# EasyEDA Pro project ProProject_keyboard_Tassel43_2024-03-30.epro, board Tassel43_RGB
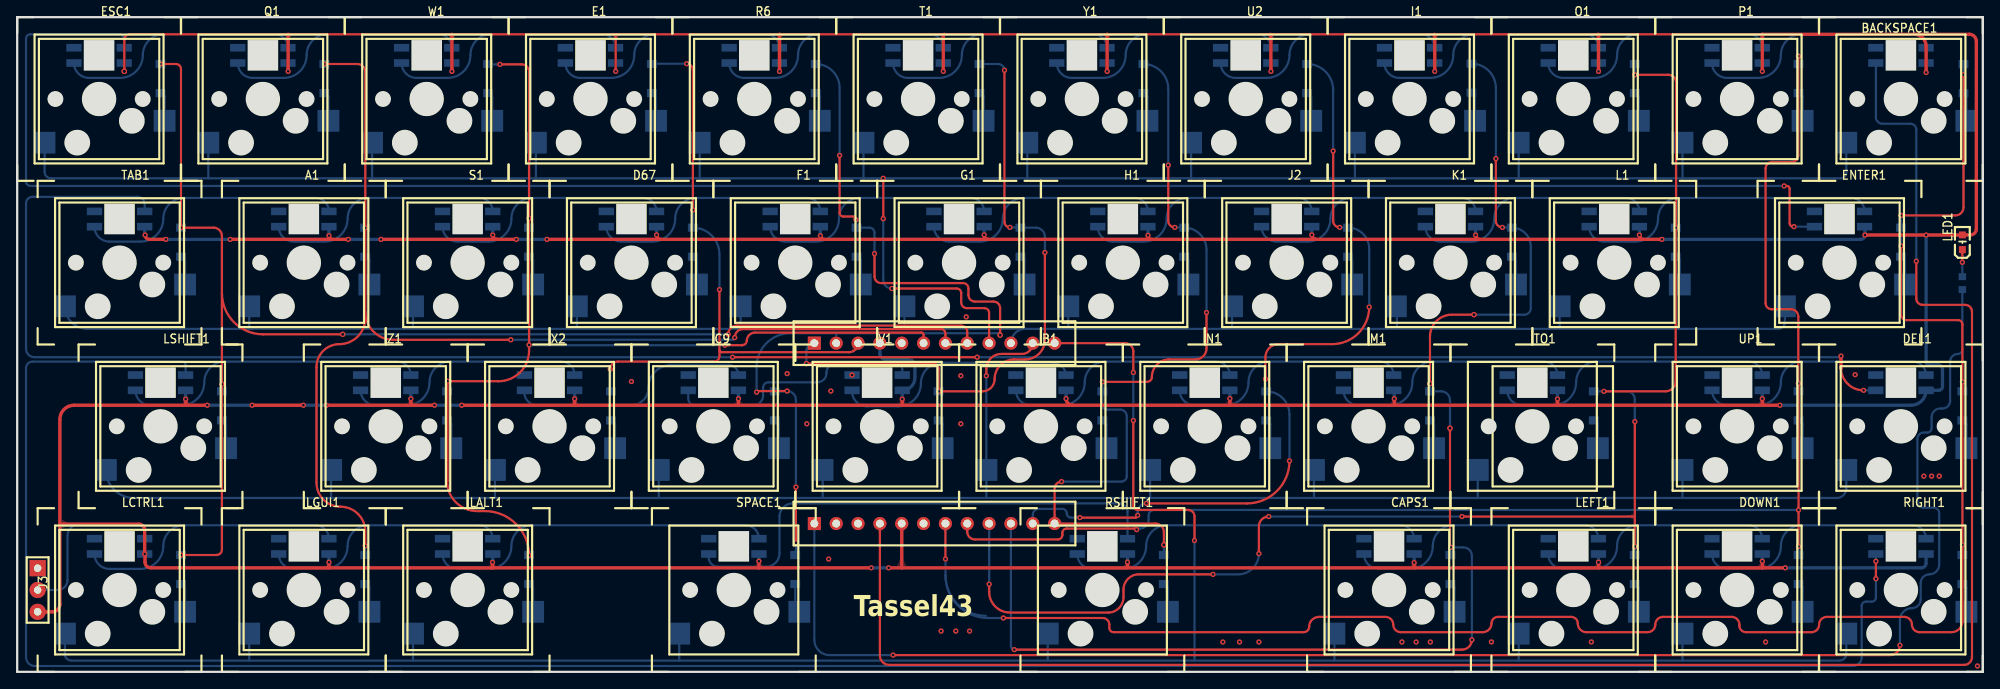
[diagram p11: board, top side]
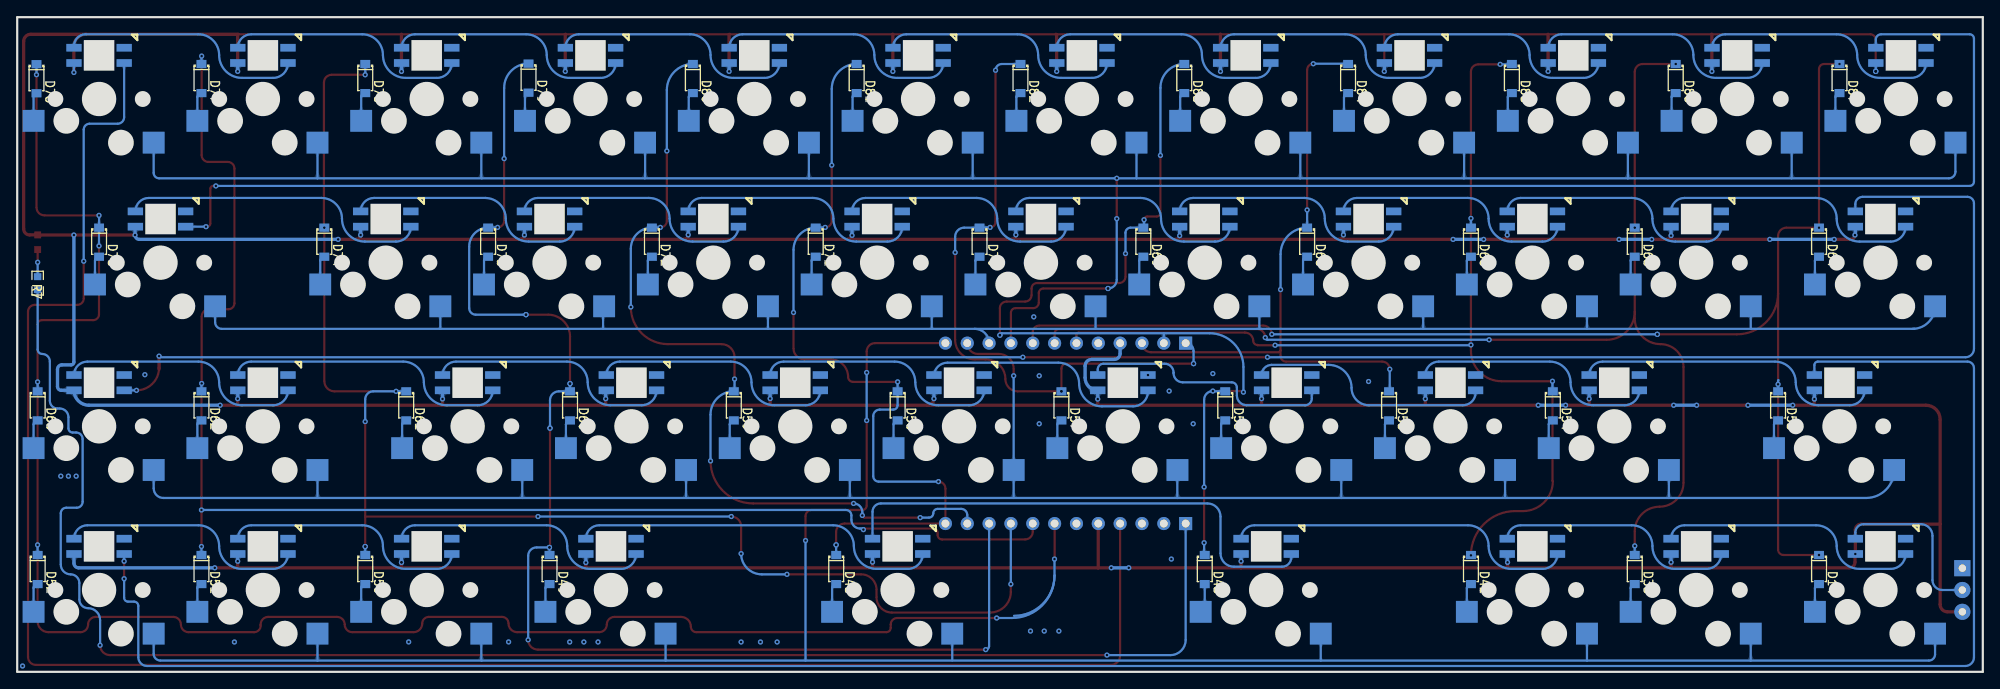
[diagram p12: board, bottom side, seen from below]

Outline 228.6 x 76.2 mm; copper layers: Top Layer, Bottom Layer. Coordinates in mm from the lower left corner of the outline.
Outline path: 0,76.2 228.6,76.2 228.6,0 0,0 0,76.2
Stack: Top Layer 0.035mm / Dielectric1 1.51mm FR4 er 4.5 / Bottom Layer 0.035mm

## Design rules (mm)
spacing Default (default): track to track 0.152, other pairs 0 to 0.152
track width Default (default): min 0.254, default 0.254, max 25.4
differential pair differentialPair (default): width min 0.127, default 0.254, max 2.54; gap min 0.152, default 0.152
via Default (default): diameter min 0.61, default 0.61, max 100.025; hole min 0.305, default 0.305, max 59.995
net GND uses gge543607(1)

## Placement (name value [footprint] x y rotation side)
A1  -  [凯华轴座+3528反贴灯]  33.34 47.62 0 top
B1  -  [凯华轴座+3528反贴灯]  119.06 28.57 0 top
BACKSPACE1  -  [凯华轴座+3528反贴灯]  219.08 66.68 0 top
C9  -  [凯华轴座+3528反贴灯]  80.96 28.57 0 top
CAPS1  -  [凯华轴座+3528反贴灯]  159.54 9.52 0 top
D14  1N4148W  [SOD-123_L2.8-W1.8-LS3.7-RD]  19.05 11.91 270 bottom
D35  1N4148W  [SOD-123_L2.8-W1.8-LS3.7-RD]  40.48 11.91 270 bottom
D41  1N4148W  [SOD-123_L2.8-W1.8-LS3.7-RD]  59.53 11.91 270 bottom
D43  1N4148W  [SOD-123_L2.8-W1.8-LS3.7-RD]  90.49 11.91 270 bottom
D45  1N4148W  [SOD-123_L2.8-W1.8-LS3.7-RD]  133.35 11.91 270 bottom
D49  1N4148W  [SOD-123_L2.8-W1.8-LS3.7-RD]  166.69 11.91 270 bottom
D50  1N4148W  [SOD-123_L2.8-W1.8-LS3.7-RD]  188.12 11.91 270 bottom
D51  1N4148W  [SOD-123_L2.8-W1.8-LS3.7-RD]  207.17 11.91 270 bottom
D52  1N4148W  [SOD-123_L2.8-W1.8-LS3.7-RD]  226.22 11.91 270 bottom
D53  1N4148W  [SOD-123_L2.8-W1.8-LS3.7-RD]  23.81 30.96 270 bottom
D54  1N4148W  [SOD-123_L2.8-W1.8-LS3.7-RD]  50 30.96 270 bottom
D55  1N4148W  [SOD-123_L2.8-W1.8-LS3.7-RD]  69.06 30.96 270 bottom
D56  1N4148W  [SOD-123_L2.8-W1.8-LS3.7-RD]  88.11 30.96 270 bottom
D57  1N4148W  [SOD-123_L2.8-W1.8-LS3.7-RD]  107.16 30.96 270 bottom
D58  1N4148W  [SOD-123_L2.8-W1.8-LS3.7-RD]  126.21 30.96 270 bottom
D59  1N4148W  [SOD-123_L2.8-W1.8-LS3.7-RD]  145.26 30.96 270 bottom
D60  1N4148W  [SOD-123_L2.8-W1.8-LS3.7-RD]  164.31 30.96 270 bottom
D61  1N4148W  [SOD-123_L2.8-W1.8-LS3.7-RD]  183.36 30.96 270 bottom
D62  1N4148W  [SOD-123_L2.8-W1.8-LS3.7-RD]  207.17 30.96 270 bottom
D63  1N4148W  [SOD-123_L2.8-W1.8-LS3.7-RD]  226.22 30.96 270 bottom
D64  1N4148W  [SOD-123_L2.8-W1.8-LS3.7-RD]  19.05 50.01 270 bottom
D65  1N4148W  [SOD-123_L2.8-W1.8-LS3.7-RD]  40.48 50.01 270 bottom
D66  1N4148W  [SOD-123_L2.8-W1.8-LS3.7-RD]  59.53 50.01 270 bottom
D67  -  [凯华轴座+3528反贴灯]  71.44 47.62 0 top
D68  1N4148W  [SOD-123_L2.8-W1.8-LS3.7-RD]  78.58 50.01 270 bottom
D69  1N4148W  [SOD-123_L2.8-W1.8-LS3.7-RD]  97.63 50.01 270 bottom
D70  1N4148W  [SOD-123_L2.8-W1.8-LS3.7-RD]  116.68 50.01 270 bottom
D71  1N4148W  [SOD-123_L2.8-W1.8-LS3.7-RD]  135.73 50.01 270 bottom
D72  1N4148W  [SOD-123_L2.8-W1.8-LS3.7-RD]  154.78 50.01 270 bottom
D73  1N4148W  [SOD-123_L2.8-W1.8-LS3.7-RD]  173.83 50.01 270 bottom
D74  1N4148W  [SOD-123_L2.8-W1.8-LS3.7-RD]  192.88 50.01 270 bottom
D75  1N4148W  [SOD-123_L2.8-W1.8-LS3.7-RD]  219.08 50.01 270 bottom
D76  1N4148W  [SOD-123_L2.8-W1.8-LS3.7-RD]  226.36 69.04 270 bottom
D77  1N4148W  [SOD-123_L2.8-W1.8-LS3.7-RD]  207.17 69.06 270 bottom
D78  1N4148W  [SOD-123_L2.8-W1.8-LS3.7-RD]  188.12 69.06 270 bottom
D79  1N4148W  [SOD-123_L2.8-W1.8-LS3.7-RD]  169.13 69.1 270 bottom
D80  1N4148W  [SOD-123_L2.8-W1.8-LS3.7-RD]  150.02 69.06 270 bottom
D81  1N4148W  [SOD-123_L2.8-W1.8-LS3.7-RD]  130.97 69.06 270 bottom
D82  1N4148W  [SOD-123_L2.8-W1.8-LS3.7-RD]  111.92 69.06 270 bottom
D83  1N4148W  [SOD-123_L2.8-W1.8-LS3.7-RD]  92.87 69.06 270 bottom
D84  1N4148W  [SOD-123_L2.8-W1.8-LS3.7-RD]  73.82 69.06 270 bottom
D85  1N4148W  [SOD-123_L2.8-W1.8-LS3.7-RD]  54.77 69.06 270 bottom
D86  1N4148W  [SOD-123_L2.8-W1.8-LS3.7-RD]  35.72 69.06 270 bottom
D87  1N4148W  [SOD-123_L2.8-W1.8-LS3.7-RD]  16.67 69.06 270 bottom
DEL1  -  [凯华轴座+3528反贴灯]  219.08 28.57 0 top
DOWN1  -  [凯华轴座+3528反贴灯]  200.03 9.52 0 top
E1  -  [凯华轴座+3528反贴灯]  66.67 66.68 0 top
ENTER1  -  [凯华轴座+3528反贴灯]  211.93 47.62 0 top
ESC1  -  [凯华轴座+3528反贴灯]  9.52 66.68 0 top
F1  -  [凯华轴座+3528反贴灯]  90.49 47.62 0 top
G1  -  [凯华轴座+3528反贴灯]  109.54 47.62 0 top
H1  -  [凯华轴座+3528反贴灯]  128.59 47.62 0 top
I1  -  [凯华轴座+3528反贴灯]  161.93 66.68 0 top
J2  -  [凯华轴座+3528反贴灯]  147.64 47.62 0 top
J3  -  [排针3P]  2.38 9.52 270 top
K1  -  [凯华轴座+3528反贴灯]  166.69 47.62 0 top
L1  -  [凯华轴座+3528反贴灯]  185.74 47.62 0 top
LALT1  -  [凯华轴座+3528反贴灯]  52.39 9.52 0 top
LCTRL1  -  [凯华轴座+3528反贴灯]  11.9 9.52 0 top
LED1  TJ-S1608SW6TGLC2R-A5  [LED0603-R-RD_RED]  226.22 50.01 90 top
LEFT1  -  [凯华轴座+3528反贴灯]  180.98 9.52 0 top
LGUI1  -  [凯华轴座+3528反贴灯]  33.34 9.52 0 top
LSHIFT1  -  [凯华轴座+3528反贴灯]  16.67 28.57 0 top
M1  -  [凯华轴座+3528反贴灯]  157.16 28.57 0 top
N1  -  [凯华轴座+3528反贴灯]  138.11 28.57 0 top
O1  -  [凯华轴座+3528反贴灯]  180.98 66.68 0 top
P1  -  [凯华轴座+3528反贴灯]  200.03 66.68 0 top
Q1  -  [凯华轴座+3528反贴灯]  28.57 66.68 0 top
R6  -  [凯华轴座+3528反贴灯]  85.72 66.68 0 top
R7  1kΩ  [R0603]  226.22 45.24 90 bottom
RIGHT1  -  [凯华轴座+3528反贴灯]  219.08 9.52 0 top
RSHIFT1  -  [凯华轴座+3528反贴灯]  126.21 9.52 0 top
S1  -  [凯华轴座+3528反贴灯]  52.39 47.62 0 top
SPACE1  -  [凯华轴座+3528反贴灯]  83.34 9.52 0 top
T1  -  [凯华轴座+3528反贴灯]  104.77 66.68 0 top
TAB1  -  [凯华轴座+3528反贴灯]  11.9 47.62 0 top
TO1  -  [凯华轴座+3528反贴灯]  176.21 28.57 0 top
U2  -  [凯华轴座+3528反贴灯]  142.88 66.68 0 top
U5  -  [1X12排针]  95.25 14.72 90 top
U6  -  [1X12排针]  95.25 35.72 90 top
UP1  -  [凯华轴座+3528反贴灯]  200.03 28.57 0 top
V1  -  [凯华轴座+3528反贴灯]  100.01 28.57 0 top
W1  -  [凯华轴座+3528反贴灯]  47.62 66.68 0 top
X2  -  [凯华轴座+3528反贴灯]  61.91 28.57 0 top
Y1  -  [凯华轴座+3528反贴灯]  123.83 66.68 0 top
Z1  -  [凯华轴座+3528反贴灯]  42.86 28.57 0 top

## Footprints (pads in the part's own frame, mm; a bottom-side part is the same pattern mirrored in y, then rotated)
1X12排针
  rect 1.524x1.524 hole 0.914: 1(2.54,2.54)
  round 1.524 hole 0.914: 2(2.541,0) 3(2.541,-2.54) 4(2.541,-5.08) 5(2.541,-7.62) 6(2.541,-10.16) 7(2.541,-12.7) 8(2.541,-15.24) 9(2.541,-17.78) 10(2.541,-20.32) 11(2.541,-22.86) 12(2.541,-25.4)
LED0603-R-RD_RED
  rect 0.8x0.8 smd: 1(0.851,0) 2(-0.851,0)
R0603
  rect 0.806x0.864 smd: 1(-0.753,0) 2(0.753,0)
SOD-123_L2.8-W1.8-LS3.7-RD
  rect 0.95x1.15 smd: 1(-1.692,0) 2(1.692,0)
凯华轴座+3528反贴灯
  rect 1.778x0.889 smd far side: 1(2.921,4.191) 2(2.921,5.969) 5(-2.921,5.969) 6(-2.921,4.191)
  rect 2.54x2.54 smd far side: 3(-6.35,-5.08) 4(7.62,-2.54)
排针3P
  rect 1.879x1.879 hole 0.864: 1(-2.54,0)
  round 1.879 hole 0.864: 2(0,0) 3(2.54,0)

## Nets
As in the schematic.

## Via types
v1: diameter 0.61, hole 0.305, Top Layer to Bottom Layer, 197 vias

## Routing (per net, layer and track width the routed paths; a pad name or vN(x,y) marks a point on that pad's centre or on a via; arc(x,y) is an arc through that point)
GND:
  vias: v1(71.44,33.79) v1(89.55,34.71) v1(91.83,28.87) v1(94.37,13.12) v1(94.63,32.68) v1(97.09,34.54) v1(107.45,4.74) v1(109.16,4.74) v1(109.74,34.46) v1(109.74,28.87) v1(110.37,41.32) v1(110.75,4.74) v1(140.22,3.47) v1(142.16,3.47) v1(144.41,3.47) v1(161.05,3.47) v1(162.7,3.47) v1(164.35,3.47) v1(171.45,3.48) v1(183.07,3.48) v1(203.34,3.47) v1(213.75,34.59) v1(221.74,22.77) v1(222.64,22.77) v1(223.53,22.77) v1(227.98,0.68)
V1_4: length 3.5
  Bottom Layer w0.254: V1.4 107.63,28.79 arc(107.49,29.12) D57.2
V1_6: length 29.7
  Bottom Layer w0.254: 121.98,34.42 arc(121.52,35.52) 120.42,35.98 107.51,35.98 arc(105.81,35.28) 105.1,33.57 arc(104.32,31.68) 102.43,30.9 98.83,30.9 arc(97.6,31.41) 97.09,32.64
VCC: length 1066.3
  Top Layer w0.254: 202.92,74.21 69.6,74.21 ; 69.6,74.21 13.09,74.21 arc(12.64,74.02) 12.46,73.57 v1(12.46,69.89) ; 69.6,74.21 arc(69.61,74.21) 69.61,74.2 v1(69.61,69.89) ; 14.82,16.53 arc(14.82,16.55) 14.79,16.56
  Top Layer w0.381: 122.75,31.03 102.93,31.03 ; 122.75,31.03 141.12,31.03 ; 122.75,31.03 arc(122.21,31.26) v1(121.98,31.8) ; 102.93,31.03 v1(102.93,31.74) ; 102.93,31.03 83.88,31.03 ; 19.61,31.03 6.61,31.03 arc(5.45,30.55) 4.96,29.38 4.96,17.2 ; 19.61,31.03 v1(22.11,31.03) ; 19.61,31.03 19.61,31.73 arc(19.6,31.74) v1(19.59,31.75) ; 102.88,12.11 129.04,12.11 ; 102.88,12.11 v1(101.36,12.11) ; 102.88,12.11 arc(102.87,12.11) 102.87,12.12 U5.5 ; 129.04,12.11 162.5,12.11 ; 129.04,12.11 arc(129.1,12.13) 129.13,12.19 v1(129.13,12.77) ; v1(160.16,31.79) 160.16,31.14 arc(160.19,31.06) 160.27,31.03 ; 83.88,31.03 64.83,31.03 ; 83.88,31.03 v1(83.88,31.79) ; 64.83,31.03 v1(64.83,31.78) ; 64.83,31.03 v1(51.7,31.03) ; v1(126.76,69.89) 126.76,74.18 arc(126.76,74.2) 126.78,74.21 ; v1(99.33,12.11) 86.26,12.11 ; 86.26,12.11 v1(86.26,12.87) ; 86.26,12.11 55.26,12.11 ; 202.96,31.03 v1(202.96,31.79) ; 202.96,31.03 v1(205,31.03) ; 202.96,31.03 179.16,31.03 ; v1(33.29,31.03) v1(27.32,31.03) ; v1(179.13,31.76) 179.13,31.05 arc(179.14,31.04) 179.16,31.03 ; 45.9,31.03 v1(48.52,31.03) ; 45.9,31.03 v1(35.95,31.03) ; 45.9,31.03 arc(45.82,31.06) 45.78,31.15 v1(45.78,31.78) ; 112.91,50.33 131.98,50.33 ; 112.91,50.33 93.84,50.33 ; 112.91,50.33 arc(112.59,50.47) 112.46,50.79 v1(112.46,50.86) ; 131.98,50.33 151.09,50.33 ; 131.98,50.33 arc(131.65,50.47) v1(131.51,50.8) ; 220.61,74.21 227.02,74.21 arc(227.61,73.97) 227.85,73.38 227.85,51.55 arc(227.65,51.06) 227.15,50.86 LED1.1 arc(226.22,50.85) 226.21,50.84 v1(222.01,50.84) v1(214.9,50.84) ; 220.61,74.21 202.92,74.21 arc(202.95,74.2) 202.96,74.17 v1(202.96,69.89) ; 220.61,74.21 arc(221.6,73.8) 222.01,72.81 v1(222.01,69.77) ; v1(50.56,69.89) 50.56,74.21 ; v1(183.91,69.89) 183.91,74.2 arc(183.9,74.21) 183.89,74.21 ; 170.11,50.33 189.17,50.33 ; 170.11,50.33 151.09,50.33 ; 170.11,50.33 arc(169.76,50.48) v1(169.61,50.84) ; 189.17,50.33 v1(191.27,50.33) ; 189.17,50.33 arc(188.81,50.48) v1(188.66,50.84) ; 160.27,31.03 141.12,31.03 ; 160.27,31.03 179.16,31.03 ; 141.12,31.03 arc(141.06,31.06) 141.03,31.12 v1(141.03,31.81) ; v1(162.47,12.72) 162.47,12.14 arc(162.47,12.12) 162.5,12.11 ; 55.26,12.11 36.21,12.11 ; 55.26,12.11 arc(55.27,12.11) 55.27,12.12 v1(55.27,12.74) ; 36.21,12.11 15.51,12.11 arc(15.06,12.3) 14.87,12.75 14.87,13.67 arc(14.86,13.7) v1(14.82,13.72) 14.82,16.53 arc(14.63,16.99) 14.16,17.19 4.98,17.19 arc(4.97,17.19) 4.96,17.2 ; 36.21,12.11 arc(36.24,12.12) 36.26,12.16 v1(36.26,12.75) ; v1(88.66,69.89) 88.66,74.21 arc(88.66,74.21) 88.66,74.21 ; 74.88,50.33 93.84,50.33 ; 74.88,50.33 v1(61.61,50.33) ; 74.88,50.33 arc(74.51,50.49) v1(74.36,50.85) ; 93.84,50.33 arc(93.53,50.46) v1(93.41,50.76) ; v1(17.28,50.33) 15.38,50.33 arc(15.02,50.48) v1(14.87,50.84) ; 162.5,12.11 183.89,12.11 ; 4.96,17.2 4.96,7.83 arc(4.72,7.23) 4.12,6.98 J3.3 ; v1(24.78,50.33) 36.7,50.33 ; 36.7,50.33 v1(38.51,50.33) ; 36.7,50.33 arc(36.39,50.46) v1(36.26,50.78) ; 183.89,12.11 202.96,12.11 ; 183.89,12.11 arc(183.9,12.11) 183.91,12.12 v1(183.91,12.74) ; v1(202.96,12.87) 202.96,12.11 arc(202.96,12.11) 202.96,12.11 ; 55.81,50.33 v1(58.05,50.33) ; 55.81,50.33 v1(42.3,50.33) ; 55.81,50.33 arc(55.46,50.48) v1(55.31,50.84) ; 151.09,50.33 arc(150.71,50.49) v1(150.56,50.86) ; v1(107.71,69.89) 107.71,74.11 arc(107.73,74.18) 107.8,74.21 ; v1(164.86,69.89) 164.86,74.19 arc(164.85,74.2) 164.84,74.21 ; v1(205.62,12.11) 202.96,12.11 ; v1(31.51,69.89) 31.51,74.18 arc(31.51,74.2) 31.53,74.21 ; v1(145.81,69.89) 145.81,74.16 arc(145.79,74.2) 145.76,74.21
  Bottom Layer w0.254: ESC1.1 v1(12.44,69.91) arc(12.45,69.9) v1(12.46,69.89) ; v1(222.01,69.77) 222.01,70.86 arc(222,70.86) BACKSPACE1.1 ; W1.1 arc(50.55,70.86) 50.56,70.85
  Bottom Layer w0.381: 131.51,51.82 v1(131.51,50.8) ; v1(58.05,50.33) v1(61.61,50.33) ; v1(202.96,69.89) 202.96,70.86 arc(202.95,70.86) P1.1 ; 112.46,51.82 v1(112.46,50.86) ; N1.1 v1(141.03,31.81) ; v1(222.01,50.84) 222.01,36.05 arc(222.1,35.82) 222.32,35.73 223.4,35.73 arc(223.76,35.58) 223.91,35.22 223.91,33.2 arc(223.79,32.89) 223.48,32.77 DEL1.1 arc(221.49,31.54) 220.26,31.03 v1(205,31.03) ; v1(205.62,12.11) 221.46,12.11 arc(221.84,12.26) 222,12.64 RIGHT1.1 ; v1(42.3,50.33) v1(38.51,50.33) ; LGUI1.1 v1(36.26,12.75) ; 50.56,70.85 v1(50.56,69.89) ; 36.26,51.82 v1(36.26,50.78) ; RSHIFT1.1 v1(129.13,12.77) ; v1(102.93,31.74) V1.1 arc(103.97,33.2) 104.41,34.24 104.41,35.6 arc(104.18,36.14) 103.64,36.36 101.02,36.36 arc(100.53,36.57) 100.33,37.05 U6.4 ; v1(51.7,31.03) v1(48.52,31.03) ; UP1.1 202.95,31.8 arc(202.95,31.79) v1(202.96,31.79) ; v1(183.91,12.74) 183.91,13.71 arc(183.9,13.71) LEFT1.1 ; v1(164.86,69.89) 164.86,70.86 arc(164.85,70.86) I1.1 ; O1.1 183.9,69.9 arc(183.9,69.89) v1(183.91,69.89) ; v1(169.61,50.84) 169.61,51.82 ; v1(191.27,50.33) 214.39,50.33 arc(214.75,50.48) v1(214.9,50.84) 214.9,51.77 arc(214.88,51.8) 214.85,51.82 ; v1(160.16,31.79) 160.16,32.69 arc(160.14,32.74) M1.1 ; X2.1 v1(64.83,31.78) ; v1(107.71,69.89) 107.71,70.85 arc(107.7,70.86) T1.1 ; 14.82,51.82 14.82,50.89 arc(14.84,50.86) v1(14.87,50.84) ; SPACE1.1 v1(86.26,12.87) ; v1(88.66,69.89) 88.66,70.85 arc(88.65,70.86) R6.1 ; TO1.1 v1(179.13,31.76) ; 150.56,51.82 v1(150.56,50.86) ; v1(188.66,50.84) 188.66,51.82 ; 74.36,51.82 v1(74.36,50.85) ; v1(202.96,12.87) 202.96,13.71 arc(202.95,13.71) DOWN1.1 ; E1.1 69.59,69.9 arc(69.6,69.9) v1(69.61,69.89) ; CAPS1.1 v1(162.47,12.72) ; v1(45.78,31.78) Z1.1 ; 55.31,51.82 v1(55.31,50.84) ; 93.41,51.82 v1(93.41,50.76) ; v1(24.78,50.33) v1(17.28,50.33) ; v1(35.95,31.03) v1(33.29,31.03) ; C9.1 v1(83.88,31.79) ; B1.1 v1(121.98,31.8) ; v1(145.81,69.89) 145.81,70.86 arc(145.8,70.86) U2.1 ; v1(31.51,69.89) 31.51,70.85 arc(31.5,70.86) 31.49,70.87 ; LSHIFT1.1 v1(19.59,31.75) ; v1(126.76,69.89) 126.76,70.86 arc(126.75,70.86) Y1.1 ; v1(101.36,12.11) v1(99.33,12.11) ; v1(27.32,31.03) v1(22.11,31.03) ; LALT1.1 55.31,12.78 arc(55.3,12.75) v1(55.27,12.74)
A1_4: length 3.5
  Bottom Layer w0.254: A1.4 40.96,47.84 arc(40.82,48.17) D65.2
A1_6: length 29.7
  Bottom Layer w0.254: S1.2 arc(54.85,54.7) 53.74,55.16 40.84,55.16 arc(39.13,54.45) 38.43,52.75 arc(37.64,50.86) 35.76,50.08 32.15,50.08 arc(30.92,50.59) 30.41,51.82
B1_4: length 3.5
  Bottom Layer w0.254: B1.4 126.68,28.79 arc(126.54,29.12) D58.2
B1_6: length 29.7
  Bottom Layer w0.254: B1.6 arc(116.65,31.54) 117.88,31.03 121.49,31.03 arc(123.37,31.81) 124.15,33.7 arc(124.86,35.4) 126.56,36.11 139.47,36.11 arc(140.58,35.65) N1.2
BACKSPACE1_2: length 29.8
  Bottom Layer w0.254: BACKSPACE1.2 222,72.84 arc(221.6,73.81) 220.63,74.21 207.53,74.21 arc(205.82,73.5) 205.12,71.8 arc(204.33,69.91) 202.45,69.13 198.84,69.13 arc(197.61,69.64) P1.6
C9_4: length 3.5
  Bottom Layer w0.254: C9.4 88.58,28.79 arc(88.44,29.12) D56.2
C9_6: length 30.5
  Bottom Layer w0.254: C9.6 78.04,31.82 arc(78.27,31.26) 78.83,31.03 85.61,31.03 arc(86.42,31.36) 86.75,32.17 86.75,33.09 arc(86.93,33.52) 87.36,33.7 93.04,33.7 arc(93.8,34.01) 94.12,34.77 94.12,34.84 arc(94.42,35.56) 95.13,35.86 102.28,35.86 arc(102.74,35.67) 102.93,35.21 V1.2
CAPLED: length 190.7
  Top Layer w0.254: v1(101.87,1.95) 217.82,1.95 arc(218.62,2.28) v1(218.96,3.09)
  Bottom Layer w0.254: U5.1 92.71,3.71 arc(93.23,2.46) 94.47,1.95 v1(101.87,1.95) ; R7.1 226.22,37.53 arc(226.07,37.15) 225.69,37 arc(225.06,36.74) 224.8,36.11 224.8,31.54 arc(224.54,30.91) 223.91,30.65 223.66,30.65 arc(222.94,30.35) 222.64,29.63 222.64,28.35 arc(222.5,28) 222.15,27.85 221.75,27.85 arc(221.21,27.63) 220.99,27.09 220.99,19.79 arc(221.19,19.3) 221.69,19.1 222.9,19.1 arc(223.35,18.91) 223.53,18.46 223.53,12.49 arc(223.2,11.68) 222.39,11.34 arc(221.67,11.05) 221.37,10.33 221.37,8.42 arc(221.07,7.71) 220.36,7.41 arc(219.37,7) 218.96,6.01 v1(218.96,3.09)
CAPS1_4: length 3.5
  Bottom Layer w0.254: CAPS1.4 167.16,9.74 arc(167.03,10.07) D49.2
CAPS1_6: length 32.1
  Bottom Layer w0.254: LEFT1.2 arc(183.44,16.6) 182.33,17.06 167.05,17.06 arc(165.34,16.35) 164.63,14.65 arc(163.85,12.76) 161.97,11.98 158.36,11.98 arc(157.13,12.49) CAPS1.6
COL0: length 161.2
  Top Layer w0.254: 23.81,44.08 v1(23.81,33.47) 23.81,14.23 arc(23.62,13.78) 23.17,13.6 v1(19.05,13.6) ; 23.81,44.08 23.81,50.73 arc(23.53,51.41) 22.84,51.7 v1(19.05,51.7) 19.05,70.16 arc(18.88,70.58) 18.46,70.75 v1(16.67,70.75) ; 23.81,44.08 arc(25.21,40.69) 28.61,39.28 v1(37.86,39.28) ; U6.8 110.49,39.55 arc(110.27,40.08) 109.74,40.3 83.7,40.3 arc(82.99,40) v1(82.69,39.28)
  Bottom Layer w0.254: D53.1 v1(23.81,33.47) 23.81,33.9 arc(23.8,33.94) 23.76,33.95 ; v1(37.86,39.28) v1(82.69,39.28)
COL1: length 139.5
  Top Layer w0.254: v1(57.41,38.65) 43.74,38.65 arc(41.43,39.6) 40.48,41.91 ; 40.48,41.91 40.48,41.15 arc(39.6,39.02) 37.48,38.14 arc(35.59,37.36) 34.81,35.47 34.81,22.01 arc(35.63,20.04) 37.6,19.22 arc(39.64,18.38) 40.48,16.34 v1(40.48,14.66) ; 40.48,41.91 v1(40.48,51.7) 40.48,69.83 arc(40.21,70.48) 39.56,70.75 v1(35.72,70.75) ; U6.7 107.95,39.39 arc(107.8,39.75) 107.44,39.89 84.24,39.89 arc(83.67,39.54) v1(83.45,38.9)
  Bottom Layer w0.254: v1(40.48,14.66) D35.1 ; v1(57.41,38.65) 83.2,38.65 arc(83.38,38.72) v1(83.45,38.9)
COL2: length 125.5
  Top Layer w0.254: v1(82.31,38.02) 84.34,38.02 84.37,38.05 arc(84.71,38.19) 84.85,38.52 arc(85.13,39.21) 85.81,39.49 105.16,39.49 arc(105.34,39.42) 105.41,39.24 U6.6 ; v1(56.13,70.71) 58.68,70.71 arc(59.28,70.46) 59.53,69.86 v1(59.53,52.78) v1(59.53,38.05) 59.53,37.37 arc(58.49,34.86) 55.98,33.82 v1(50.05,33.82) 50.05,22.23 50,22.18 arc(51.02,19.73) 53.48,18.71 54.38,18.71 arc(58.02,17.2) v1(59.53,13.56)
  Bottom Layer w0.254: v1(59.53,38.05) 59.56,38.02 v1(82.31,38.02) ; v1(50.05,33.82) 50.05,32.69 50,32.65 ; v1(56.13,70.71) 54.81,70.71 arc(54.78,70.72) D85.1 ; D66.1 v1(59.53,52.78)
COL3: length 73.3
  Top Layer w0.254: v1(81.67,44.49) 81.67,37.4 ; 81.67,37.4 81.87,37.2 96.73,37.2 arc(97.48,37.51) U6.3 ; 81.67,37.4 81.67,36.74 arc(81.49,36.3) 81.04,36.11 69.86,36.11 arc(69.23,35.85) v1(68.97,35.22) ; v1(78.58,53.76) 78.58,70.06 arc(78.37,70.57) v1(77.86,70.78)
  Bottom Layer w0.254: v1(81.67,44.49) 81.67,48.61 arc(80.77,50.79) D68.1 v1(78.58,53.76) ; v1(77.86,70.78) 73.85,70.78 arc(73.83,70.77) D84.1 ; v1(68.97,35.22) 68.97,32.73 arc(69,32.67) D55.1
COL4: length 109.6
  Top Layer w0.254: v1(85.99,32.55) 85.99,32.68 v1(89.55,32.68) ; v1(99.71,48.68) 99.71,46 arc(99.93,45.47) 100.46,45.25 109.99,45.25 arc(110.44,45.07) 110.63,44.62 110.63,43.86 arc(110.85,43.32) 111.39,43.09 113.56,43.09 arc(114.09,42.87) 114.31,42.34 v1(114.31,39.19) ; v1(95.64,60.11) 95.64,53.44 arc(95.77,53.13) 96.08,53 97.17,53 arc(97.44,52.89) v1(97.55,52.62) ; v1(90.56,21.5) v1(90.56,15.03)
  Bottom Layer w0.254: 95.27,39.41 114.09,39.41 arc(114.25,39.35) v1(114.31,39.19) ; 95.27,39.41 89.93,39.41 arc(87.14,38.26) 85.99,35.47 v1(85.99,32.55) ; 95.27,39.41 arc(95.26,39.4) 95.25,39.39 U6.2 ; v1(99.71,48.68) 99.71,51.1 arc(99.53,51.52) 99.11,51.7 D69.1 arc(97.57,51.72) 97.55,51.78 v1(97.55,52.62) ; D56.1 89.51,32.65 arc(89.54,32.66) v1(89.55,32.68) arc(90.26,32.38) 90.56,31.66 v1(90.56,21.5) ; v1(90.56,15.03) 90.56,13.78 90.44,13.65 arc(90.45,13.61) D43.1 ; v1(95.64,60.11) 95.64,67.98 arc(94.83,69.94) D83.1
COL5: length 75.7
  Top Layer w0.254: v1(114.82,70.02) 114.82,52.37 arc(115,51.92) v1(115.45,51.73) ; v1(91.79,35.87) 106.59,35.87 arc(106.99,35.71) 107.16,35.31 v1(107.16,32.65) 112.25,32.65 arc(113.26,33.07) 113.68,34.08 arc(114.35,35.69) 115.96,36.36 117.23,36.36 arc(118.85,37.03) 119.52,38.65 v1(119.52,48.81)
  Bottom Layer w0.254: v1(115.45,51.73) 116.65,51.73 arc(116.67,51.72) D70.1 118.47,51.7 arc(119.21,51.39) 119.52,50.65 v1(119.52,48.81) ; D82.1 114.09,70.75 arc(114.61,70.54) v1(114.82,70.02) ; v1(91.79,35.87) 91.79,37.34 arc(92.06,37.99) U6.1
COL6: length 94.1
  Top Layer w0.254: v1(126.21,33.75) 131.38,33.75 arc(131.79,33.92) 131.96,34.33 arc(132.56,35.77) 134,36.36 137.04,36.36 arc(137.94,36.74) 138.31,37.63 v1(138.31,41.82) ; v1(133.36,14.77) 133.36,16.28 arc(133.07,16.97) 132.38,17.26 U5.12 120.65,21.33 arc(120.89,21.9) v1(121.46,22.14) ; v1(133.87,58.97) 133.87,52.49 arc(134.09,51.95) v1(134.63,51.73)
  Bottom Layer w0.254: v1(126.21,33.75) D58.1 126.21,31.03 arc(126.36,30.67) 126.72,30.52 128.28,30.52 arc(128.82,30.3) 129.04,29.76 129.04,22.77 arc(128.86,22.33) 128.41,22.14 v1(121.46,22.14) ; v1(138.31,41.82) 138.31,49.12 arc(137.56,50.94) D71.1 arc(135.72,51.72) 135.7,51.73 v1(134.63,51.73) ; 133.35,14.1 133.36,14.11 v1(133.36,14.77) ; v1(133.87,58.97) 133.87,67.85 arc(133.02,69.9) D81.1
COL7: length 97.6
  Top Layer w0.254: v1(145.17,34.08) 145.17,36.62 arc(145.62,37.7) 146.7,38.14 152.92,38.14 arc(155.97,39.41) v1(157.24,42.46) ; v1(123.58,17.95) 130.06,17.95 arc(130.24,18.02) v1(130.31,18.2) ; v1(153.05,60.62) 153.05,52.49 arc(153.27,51.95) v1(153.81,51.73) ; v1(131.33,19.6) 143.01,19.6 arc(146.52,21.05) v1(147.97,24.55)
  Bottom Layer w0.254: v1(147.97,24.55) 147.97,29.94 arc(147.17,31.85) D59.1 arc(145.2,32.67) 145.17,32.73 v1(145.17,34.08) ; v1(123.58,17.95) 122.57,17.95 arc(122.21,18.1) 122.06,18.46 arc(121.91,18.82) 121.55,18.97 118.82,18.97 arc(118.32,18.76) 118.11,18.26 U5.11 ; v1(157.24,42.46) 157.24,49.24 arc(156.52,50.98) D72.1 arc(154.77,51.72) 154.75,51.73 v1(153.81,51.73) ; v1(130.31,18.2) 130.31,18.58 arc(130.61,19.3) v1(131.33,19.6) ; v1(153.05,60.62) 153.05,67.72 arc(152.16,69.86) D80.1
COL8: length 155.3
  Top Layer w0.254: v1(166.63,28.36) 166.63,14.54 ; v1(115.96,2.58) 168.03,2.58 arc(168.84,2.92) v1(169.18,3.72) ; v1(164.31,33.55) 164.31,39.02 arc(165.05,40.82) 166.86,41.57 v1(169.43,41.57) ; v1(171.97,59.73) 171.97,52.49 arc(172.19,51.95) v1(172.73,51.73)
  Bottom Layer w0.254: v1(171.97,59.73) 171.97,67.96 arc(171.14,69.96) D79.1 ; v1(169.18,3.72) 169.18,13.5 arc(168.89,14.19) 168.19,14.48 v1(166.7,14.48) 166.7,13.61 arc(166.69,13.6) D49.1 ; v1(166.63,28.36) 166.63,31.61 arc(166.33,32.34) 165.6,32.65 D60.1 v1(164.31,33.55) ; v1(172.73,51.73) 173.8,51.73 arc(173.82,51.72) D73.1 arc(175.39,51.05) 176.03,49.5 176.03,42.33 arc(175.81,41.79) 175.27,41.57 v1(169.43,41.57) ; U5.10 115.57,2.97 arc(115.68,2.7) v1(115.96,2.58)
COL9: length 166.3
  Top Layer w0.254: v1(184.53,32.65) 191.7,32.65 arc(192.54,32.99) 192.88,33.83 v1(192.88,51.7) arc(192.91,51.71) 192.92,51.74 192.92,68.6 arc(192.66,69.23) 192.03,69.49 v1(188.13,69.49) ; v1(188.13,14.58) 188.13,18.08 ; 188.13,18.08 v1(168.03,18.08) ; 188.13,18.08 v1(188.13,29.12) ; v1(144.41,13.76) 144.41,16.93 arc(144.74,17.74) v1(145.55,18.08) ; v1(139.08,11.34) 130.44,11.34 arc(129.18,10.82) 128.66,9.57 128.66,8.68 arc(128.14,7.42) 126.88,6.9 115.45,6.9 arc(113.75,7.61) 113.04,9.31 v1(113.04,10.2)
  Bottom Layer w0.254: v1(168.03,18.08) v1(145.55,18.08) ; v1(113.04,10.2) 113.04,17.25 arc(113.04,17.26) U5.9 ; D61.1 v1(184.53,32.65) 187.19,32.65 arc(187.85,32.37) 188.13,31.71 v1(188.13,29.12) ; v1(188.13,14.58) 188.13,13.61 arc(188.13,13.6) D50.1 ; D78.1 188.12,69.5 arc(188.12,69.5) v1(188.13,69.49) ; v1(139.08,11.34) 142,11.34 arc(143.7,12.05) v1(144.41,13.76)
COL10: length 166.8
  Top Layer w0.254: U5.8 110.49,16.31 arc(110.75,15.67) 111.39,15.41 121.04,15.41 arc(121.4,15.56) 121.55,15.92 121.55,16.17 arc(121.7,16.53) 122.06,16.68 130.06,16.68 arc(130.15,16.64) v1(130.19,16.55) ; v1(207.15,71.67) 207.15,60.14 arc(206.92,59.58) 206.36,59.35 204.11,59.35 arc(203.56,59.13) 203.34,58.58 203.34,42.9 arc(203.54,42.41) 204.03,42.21 206.28,42.21 arc(206.89,41.95) 207.15,41.34 v1(207.15,33.57) arc(207.16,33.56) 207.17,33.55 v1(207.17,18.84) v1(207.17,14.59)
  Bottom Layer w0.254: D77.1 207.17,71.65 arc(207.16,71.66) v1(207.15,71.67) ; D51.1 v1(207.17,14.59) ; D62.1 207.17,33.55 arc(207.16,33.56) v1(207.15,33.57) ; v1(207.17,18.84) 132.22,18.84 arc(131.77,18.65) 131.58,18.2 131.58,17.69 arc(131.29,16.98) 130.57,16.68 130.31,16.68 arc(130.22,16.64) v1(130.19,16.55)
COL11: length 225.2
  Top Layer w0.254: v1(226.36,69.5) 226.36,54.06 arc(226.08,53.4) 225.42,53.13 v1(219.09,53.13) ; v1(219.09,49.57) 219.09,41.61 arc(219.28,41.13) 219.76,40.94 225.73,40.94 arc(226.08,40.79) 226.23,40.44 v1(226.23,33.74) v1(226.23,14.77) 226.23,5.89 arc(225.86,4.99) 224.96,4.61 221.25,4.61 arc(220.62,4.87) 220.36,5.5 arc(220.1,6.13) 219.47,6.39 210.45,6.39 arc(209.82,6.13) 209.56,5.5 arc(209.3,4.87) 208.67,4.61 201.05,4.61 arc(200.51,4.84) 200.29,5.38 200.29,5.5 arc(200.03,6.13) 199.4,6.39 191.4,6.39 arc(190.77,6.13) 190.51,5.5 arc(190.25,4.87) 189.62,4.61 182.51,4.61 arc(181.79,4.91) 181.49,5.63 arc(181.27,6.17) 180.73,6.39 172.22,6.39 arc(171.68,6.17) 171.46,5.63 arc(171.16,4.91) 170.44,4.61 160.92,4.61 arc(160.29,4.87) 160.03,5.5 arc(159.77,6.13) 159.14,6.39 151.4,6.39 arc(150.59,6.06) 150.25,5.25 arc(150.07,4.8) 149.62,4.61 127.52,4.61 arc(127.16,4.76) 127.01,5.12 127.01,5.5 arc(126.79,6.04) 126.25,6.26 v1(114.69,6.26) ; U5.7 107.95,13.13 arc(107.95,13.13) v1(107.96,13.12)
  Bottom Layer w0.254: v1(107.96,13.12) 107.96,11.22 ; 107.96,11.22 arc(109.34,7.9) 112.66,6.52 ; 107.96,11.22 arc(109.41,7.72) 112.91,6.26 v1(114.69,6.26) ; v1(219.09,49.57) 219.09,51.69 arc(219.08,51.7) D75.1 219.08,53.12 arc(219.08,53.13) v1(219.09,53.13) ; v1(226.36,69.5) D76.1 ; D63.1 226.22,33.73 arc(226.22,33.74) v1(226.23,33.74) ; v1(226.23,14.77) 226.23,13.61 arc(226.23,13.6) D52.1
D14_2: length 3.5
  Bottom Layer w0.254: 19.52,6.98 19.52,9.74 arc(19.38,10.07) D14.2
D53_2: length 3.5
  Bottom Layer w0.254: LSHIFT1.4 24.29,28.79 arc(24.15,29.12) D53.2
D64_2: length 3.5
  Bottom Layer w0.254: 19.52,45.08 19.52,47.84 arc(19.38,48.17) D64.2
D67_4: length 3.5
  Bottom Layer w0.254: D67.4 79.06,47.84 arc(78.92,48.17) D68.2
D67_6: length 29.7
  Bottom Layer w0.254: F1.2 arc(92.95,54.7) 91.84,55.16 78.94,55.16 arc(77.23,54.45) 76.53,52.75 arc(75.74,50.86) 73.86,50.08 70.25,50.08 arc(69.02,50.59) 68.52,51.82
D76_2: length 3.4
  Bottom Layer w0.254: BACKSPACE1.4 226.7,67 arc(226.6,67.24) D76.2
D77_2: length 3.5
  Bottom Layer w0.254: P1.4 207.65,66.89 arc(207.51,67.22) D77.2
D78_2: length 3.5
  Bottom Layer w0.254: O1.4 188.6,66.89 arc(188.46,67.22) D78.2
D79_2: length 3.5
  Bottom Layer w0.254: 169.55,64.14 169.55,67 arc(169.43,67.29) D79.2
D80_2: length 3.5
  Bottom Layer w0.254: U2.4 150.5,66.89 arc(150.36,67.22) D80.2
D81_2: length 3.5
  Bottom Layer w0.254: Y1.4 131.44,66.89 arc(131.31,67.22) D81.2
D82_2: length 3.5
  Bottom Layer w0.254: T1.4 112.39,66.89 arc(112.26,67.22) D82.2
D83_2: length 3.5
  Bottom Layer w0.254: R6.4 93.34,66.89 arc(93.2,67.22) D83.2
D84_2: length 3.5
  Bottom Layer w0.254: E1.4 74.29,66.89 arc(74.15,67.22) D84.2
D85_2: length 3.5
  Bottom Layer w0.254: W1.4 55.24,66.89 arc(55.1,67.22) D85.2
D86_2: length 3.5
  Bottom Layer w0.254: Q1.4 36.19,66.89 arc(36.05,67.22) D86.2
DEL1_4: length 3.5
  Bottom Layer w0.254: DEL1.4 226.7,28.79 arc(226.56,29.12) D63.2
DEL1_6: length 251.3
  Top Layer w0.254: v1(111.64,36.62) v1(83.2,36.62) ; 212.1,35.4 arc(212.87,33.54) v1(214.73,32.77)
  Top Layer w0.381: v1(212.1,36.74) 212.1,35.22
  Bottom Layer w0.254: TAB1.2 14.82,54.44 arc(14.58,55.04) 13.98,55.29 1.79,55.29 arc(1.25,55.06) 1.03,54.52 1.03,37.6 arc(1.31,36.91) 2.01,36.62 v1(83.2,36.62) ; v1(212.1,36.74) 211.97,36.62 v1(111.64,36.62) ; DEL1.6 v1(214.73,32.77)
DOWN1_4: length 3.5
  Bottom Layer w0.254: DOWN1.4 207.65,9.74 arc(207.51,10.07) D51.2
DOWN1_6: length 29.7
  Bottom Layer w0.254: DOWN1.6 arc(197.61,12.49) 198.84,11.98 202.45,11.98 arc(204.33,12.76) 205.12,14.65 arc(205.82,16.35) 207.53,17.06 220.43,17.06 arc(221.54,16.6) RIGHT1.2
E1_2: length 29.7
  Bottom Layer w0.254: W1.6 arc(45.21,69.64) 46.44,69.13 50.05,69.13 arc(51.93,69.91) 52.71,71.8 arc(53.42,73.5) 55.13,74.21 68.03,74.21 arc(69.14,73.75) E1.2
ENTER1_4: length 3.5
  Bottom Layer w0.254: ENTER1.4 219.55,47.84 arc(219.41,48.17) D75.2
ENTER1_6: length 242.4
  Top Layer w0.254: v1(205.5,56.56) 205.83,56.56 arc(206.04,56.47) 206.13,56.25 206.13,52.19 arc(206.24,51.93) 206.51,51.82 v1(206.64,51.82)
  Bottom Layer w0.254: v1(205.5,56.56) 1.53,56.56 arc(1.18,56.71) 1.03,57.06 1.03,73.7 arc(1.18,74.06) 1.53,74.21 11.82,74.21 arc(12.26,74.03) 12.44,73.59 ESC1.2 ; 209.01,51.82 v1(206.64,51.82)
ESC1_4: length 3.5
  Bottom Layer w0.254: ESC1.4 17.14,66.89 arc(17,67.22) D87.2
F1_4: length 3.5
  Bottom Layer w0.254: F1.4 98.11,47.84 arc(97.97,48.17) D69.2
F1_6: length 29.7
  Bottom Layer w0.254: 87.57,51.82 arc(88.07,50.59) 89.3,50.08 92.91,50.08 arc(94.79,50.86) 95.58,52.75 arc(96.28,54.45) 97.99,55.16 110.89,55.16 arc(112,54.7) G1.2
G1_4: length 3.5
  Bottom Layer w0.254: G1.4 117.16,47.84 arc(117.02,48.17) D70.2
G1_6: length 29.7
  Bottom Layer w0.254: 106.62,51.82 arc(107.12,50.59) 108.35,50.08 111.96,50.08 arc(113.85,50.86) 114.63,52.75 arc(115.33,54.45) 117.04,55.16 129.94,55.16 arc(131.05,54.7) H1.2
H1_4: length 3.5
  Bottom Layer w0.254: H1.4 136.21,47.84 arc(136.07,48.17) D71.2
H1_6: length 29.7
  Bottom Layer w0.254: J2.2 arc(150.1,54.7) 148.99,55.16 136.09,55.16 arc(134.38,54.45) 133.68,52.75 arc(132.9,50.86) 131.01,50.08 127.4,50.08 arc(126.18,50.59) 125.67,51.82
I1_2: length 29.7
  Bottom Layer w0.254: I1.2 arc(164.39,73.75) 163.28,74.21 150.38,74.21 arc(148.67,73.5) 147.97,71.8 arc(147.18,69.91) 145.3,69.13 141.69,69.13 arc(140.46,69.64) U2.6
J2_4: length 3.5
  Bottom Layer w0.254: J2.4 155.26,47.84 arc(155.12,48.17) D72.2
J2_6: length 29.7
  Bottom Layer w0.254: 144.72,51.82 arc(145.23,50.59) 146.45,50.08 150.06,50.08 arc(151.95,50.86) 152.73,52.75 arc(153.43,54.45) 155.14,55.16 168.04,55.16 arc(169.15,54.7) K1.2
K1_4: length 3.5
  Bottom Layer w0.254: K1.4 174.31,47.84 arc(174.17,48.17) D73.2
K1_6: length 29.7
  Bottom Layer w0.254: L1.2 arc(188.2,54.7) 187.09,55.16 174.19,55.16 arc(172.48,54.45) 171.78,52.75 arc(171,50.86) 169.11,50.08 165.5,50.08 arc(164.28,50.59) 163.77,51.82
L1_4: length 3.5
  Bottom Layer w0.254: L1.4 193.36,47.84 arc(193.22,48.17) D74.2
L1_6: length 36.8
  Bottom Layer w0.254: 182.82,51.82 arc(183.33,50.59) 184.55,50.08 188.16,50.08 arc(190.05,50.86) 190.83,52.75 arc(191.53,54.45) 193.24,55.16 213.29,55.16 arc(214.4,54.7) ENTER1.2
LALT1_4: length 3.5
  Bottom Layer w0.254: 60.01,6.98 60.01,9.74 arc(59.87,10.07) D41.2
LALT1_6: length 41.6
  Bottom Layer w0.254: SPACE1.2 arc(85.81,16.6) 84.7,17.06 59.89,17.06 arc(58.18,16.35) 57.48,14.65 arc(56.69,12.76) 54.81,11.98 51.2,11.98 arc(49.97,12.49) LALT1.6
LCTRL1_2: length 20.3
  Bottom Layer w0.254: J3.2 4.7,9.52 arc(5.52,9.86) 5.85,10.67 5.85,15.83 arc(6.25,16.79) 7.21,17.19 13.85,17.19 arc(14.54,16.9) 14.82,16.22 LCTRL1.2
LCTRL1_6: length 32.1
  Bottom Layer w0.254: LGUI1.2 arc(35.8,16.6) 34.69,17.06 19.41,17.06 arc(17.7,16.35) 16.99,14.65 arc(16.21,12.76) 14.33,11.98 10.72,11.98 arc(9.49,12.49) LCTRL1.6
LEFT1_4: length 3.5
  Bottom Layer w0.254: LEFT1.4 188.6,9.74 arc(188.46,10.07) D50.2
LEFT1_6: length 29.7
  Bottom Layer w0.254: LEFT1.6 arc(178.56,12.49) 179.79,11.98 183.4,11.98 arc(185.28,12.76) 186.07,14.65 arc(186.77,16.35) 188.48,17.06 201.38,17.06 arc(202.49,16.6) DOWN1.2
LGUI1_4: length 3.5
  Bottom Layer w0.254: LGUI1.4 40.96,9.74 arc(40.82,10.07) D35.2
LGUI1_6: length 29.7
  Bottom Layer w0.254: LGUI1.6 arc(30.92,12.49) 32.15,11.98 35.76,11.98 arc(37.64,12.76) 38.43,14.65 arc(39.13,16.35) 40.84,17.06 53.74,17.06 arc(54.85,16.6) LALT1.2
LSHIFT1_6: length 36.8
  Bottom Layer w0.254: Z1.2 arc(45.32,35.65) 44.22,36.11 24.17,36.11 arc(22.46,35.4) 21.76,33.7 arc(20.97,31.81) 19.09,31.03 15.48,31.03 arc(14.25,31.54) LSHIFT1.6
M1_4: length 3.5
  Bottom Layer w0.254: M1.4 164.78,28.79 arc(164.64,29.12) D60.2
M1_6: length 29.7
  Bottom Layer w0.254: TO1.2 arc(178.68,35.65) 177.57,36.11 164.67,36.11 arc(162.96,35.4) 162.25,33.7 arc(161.47,31.81) 159.59,31.03 155.98,31.03 arc(154.75,31.54) 154.24,32.77
N1_4: length 3.5
  Bottom Layer w0.254: N1.4 145.73,28.79 arc(145.59,29.12) D59.2
N1_6: length 29.7
  Bottom Layer w0.254: M1.2 arc(159.63,35.65) 158.52,36.11 145.62,36.11 arc(143.91,35.4) 143.2,33.7 arc(142.42,31.81) 140.53,31.03 136.93,31.03 arc(135.7,31.54) N1.6
O1_2: length 29.7
  Bottom Layer w0.254: I1.6 arc(159.51,69.64) 160.74,69.13 164.35,69.13 arc(166.23,69.91) 167.02,71.8 arc(167.72,73.5) 169.43,74.21 182.33,74.21 arc(183.44,73.75) O1.2
P1_2: length 29.7
  Bottom Layer w0.254: P1.2 arc(202.49,73.75) 201.38,74.21 188.48,74.21 arc(186.77,73.5) 186.07,71.8 arc(185.28,69.91) 183.4,69.13 179.79,69.13 arc(178.56,69.64) O1.6
Q1_2: length 29.7
  Bottom Layer w0.254: 31.49,72.64 arc(31.04,73.75) 29.93,74.21 17.02,74.21 arc(15.32,73.5) 14.61,71.8 arc(13.83,69.91) 11.95,69.13 8.34,69.13 arc(7.11,69.64) ESC1.6
R6_2: length 29.7
  Bottom Layer w0.254: R6.2 arc(88.19,73.75) 87.08,74.21 74.18,74.21 arc(72.47,73.5) 71.76,71.8 arc(70.98,69.91) 69.1,69.13 65.49,69.13 arc(64.26,69.64) E1.6
R7_2: length 3.2
  Top Layer w0.254: LED1.2 v1(226.22,47.67)
  Bottom Layer w0.254: v1(226.22,47.67) R7.2
RGB: length 222.6
  Top Layer w0.254: v1(220.86,47.79) 220.86,43.46 arc(221.08,42.93) 221.61,42.71 226.55,42.71 arc(227.11,42.48) 227.34,41.92 227.34,1.72 arc(227.07,1.07) 226.42,0.8 101.42,0.8 arc(100.65,1.12) 100.33,1.9 U5.4
  Bottom Layer w0.254: v1(220.86,47.79) 220.86,63.11 arc(220.66,63.6) 220.18,63.8 216.93,63.8 arc(216.39,64.02) 216.16,64.56 216.16,70.86 arc(216.16,70.86) BACKSPACE1.6
RIGHT1_4: length 3.5
  Bottom Layer w0.254: RIGHT1.4 226.7,9.74 arc(226.56,10.07) D52.2
RIGHT1_6: length 282
  Top Layer w0.254: v1(216.16,10.84) v1(216.16,12.87)
  Bottom Layer w0.254: LSHIFT1.2 19.59,35.71 arc(19.47,35.99) 19.19,36.11 1.79,36.11 arc(1.25,35.89) 1.03,35.35 1.03,1.69 arc(1.32,0.97) 2.04,0.68 213.5,0.68 arc(214.22,0.97) 214.51,1.69 214.51,7.67 arc(214.66,8.02) 215.01,8.17 215.71,8.17 arc(216.03,8.3) 216.16,8.62 v1(216.16,10.84) ; v1(216.16,12.87) 216.16,13.71 arc(216.16,13.71) RIGHT1.6
ROW0: length 289.2
  Top Layer w0.254: v1(100.72,52.75) v1(100.72,57.45) ; v1(113.03,38.26) 113.03,41.8 arc(112.87,42.18) 112.49,42.33 110.45,42.33 arc(109.98,42.53) 109.79,42.99 109.79,44.09 arc(109.64,44.47) 109.26,44.62 v1(101.74,44.62)
  Bottom Layer w0.254: 98.43,57.45 79.38,57.45 ; 98.42,57.45 T1.3 ; 98.42,57.45 v1(100.72,57.45) ; 79.38,57.45 60.34,57.45 ; 79.38,57.45 arc(79.38,57.45) 79.37,57.46 R6.3 ; 136.51,57.45 155.6,57.45 ; 136.51,57.45 117.46,57.45 ; 136.51,57.45 arc(136.52,57.45) 136.53,57.46 U2.3 ; 155.6,57.45 174.58,57.45 ; 155.6,57.45 arc(155.58,57.45) 155.58,57.47 I1.3 ; 193.69,57.45 212.1,57.45 arc(212.54,57.63) 212.73,58.07 BACKSPACE1.3 ; 193.69,57.45 174.58,57.45 ; 193.69,57.45 arc(193.68,57.45) 193.68,57.46 P1.3 ; 117.46,57.45 100.72,57.45 ; 117.46,57.45 arc(117.47,57.45) 117.47,57.47 Y1.3 ; 41.28,57.45 22.24,57.45 ; 41.28,57.45 60.34,57.45 ; 41.28,57.45 arc(41.28,57.45) 41.27,57.46 W1.3 ; 22.24,57.45 3.95,57.45 arc(3.41,57.67) 3.19,58.21 3.19,61.58 arc(3.18,61.59) ESC1.3 ; 22.24,57.45 arc(22.23,57.45) 22.22,57.47 Q1.3 ; 60.34,57.45 arc(60.33,57.45) 60.32,57.47 E1.3 ; 174.58,57.45 arc(174.61,57.46) 174.63,57.49 174.63,61.6 ; v1(100.72,52.75) 100.72,45.63 arc(101.02,44.92) v1(101.74,44.62)
ROW1: length 230.3
  Bottom Layer w0.254: 46.05,39.92 26.99,39.92 ; 46.05,39.92 65.07,39.92 ; 46.05,39.92 arc(46.04,39.92) 46.04,39.93 S1.3 ; 84.14,39.92 65.07,39.92 ; 65.07,39.92 arc(65.08,39.92) 65.09,39.94 D67.3 ; 103.21,39.92 117.23,39.92 ; 103.21,39.92 84.14,39.92 F1.3 ; 103.21,39.92 arc(103.19,39.93) 103.19,39.94 G1.3 ; 117.23,39.92 122.18,39.92 ; 117.23,39.92 arc(116.06,39.43) U6.10 ; 8.09,39.92 26.99,39.92 A1.3 ; 8.09,39.92 7.97,39.92 arc(7.96,39.92) 7.96,39.93 arc(6.25,40.77) TAB1.3 ; 8.09,39.92 arc(8.14,39.92) 8.18,39.92 ; 122.18,39.92 141.28,39.92 ; 122.18,39.92 arc(122.22,39.94) 122.24,39.97 H1.3 ; 141.28,39.92 160.46,39.92 ; 141.28,39.92 arc(141.29,39.92) 141.29,39.93 J2.3 ; 160.46,39.92 160.46,42.42 arc(160.43,42.51) K1.3 ; 160.46,39.92 179.4,39.92 ; 179.4,39.92 204.81,39.92 arc(205.36,40.15) 205.58,40.69 ENTER1.3 ; 179.4,39.92 arc(179.39,39.92) 179.39,39.93 L1.3
ROW2: length 255.3
  Top Layer w0.254: v1(112.71,34.46) 112.71,35.27 arc(113.22,36.49) 114.44,37 116.85,37 arc(117.74,37.37) U6.11
  Bottom Layer w0.254: UP1.3 193.68,20.28 arc(193.69,20.25) 193.72,20.23 ; 93.68,20.23 112.72,20.23 ; 93.68,20.23 93.68,23.47 arc(93.68,23.49) V1.3 ; 93.68,20.23 74.6,20.23 ; 112.72,20.23 131.79,20.23 ; 112.72,20.23 arc(112.71,20.24) 112.71,20.24 B1.3 v1(112.71,34.46) ; 74.6,20.23 55.57,20.23 ; 74.6,20.23 arc(74.61,20.24) 74.61,20.25 C9.3 ; Z1.3 36.51,20.24 arc(36.51,20.24) 36.5,20.23 ; 169.86,20.23 193.72,20.23 ; 169.86,20.23 150.81,20.23 ; 169.86,20.23 arc(169.86,20.24) 169.86,20.24 TO1.3 ; 193.72,20.23 211.6,20.23 arc(212.4,20.56) 212.73,21.36 DEL1.3 ; 36.5,20.23 13.58,20.23 arc(11.27,21.19) LSHIFT1.3 ; 36.5,20.23 55.57,20.23 ; 55.57,20.23 arc(55.56,20.24) 55.56,20.24 X2.3 ; N1.3 131.76,20.26 arc(131.77,20.24) 131.79,20.23 ; 131.79,20.23 150.81,20.23 ; 150.81,20.23 arc(150.81,20.24) 150.81,20.24 M1.3
ROW3: length 287
  Top Layer w0.254: U6.12 128.83,38.26 arc(129.52,37.97) 129.81,37.28 v1(129.81,34.84) ; v1(129.81,29.25) 129.81,19.35 arc(129.95,18.99) 130.31,18.84 136.19,18.84 arc(136.7,18.63) 136.92,18.11 v1(136.92,15.28)
  Bottom Layer w0.254: 76.99,1.31 46.04,1.31 arc(46.04,1.31) 46.04,1.31 LALT1.3 ; 76.99,1.31 SPACE1.3 ; 76.99,1.31 136.92,1.31 ; DOWN1.3 193.68,1.31 arc(193.68,1.31) 193.67,1.31 ; 136.92,1.31 153.19,1.31 ; 136.92,1.31 v1(136.92,15.28) ; 153.19,1.31 174.59,1.31 ; 153.19,1.31 arc(153.19,1.31) 153.19,1.32 CAPS1.3 ; LCTRL1.3 5.55,2.03 arc(5.76,1.52) 6.27,1.31 26.99,1.31 ; RSHIFT1.3 119.86,1.31 ; 174.59,1.31 193.67,1.31 ; 174.59,1.31 arc(174.62,1.32) 174.63,1.34 174.63,4.44 ; 193.67,1.31 211.94,1.31 arc(212.5,1.54) 212.73,2.09 RIGHT1.3 ; LGUI1.3 26.99,1.32 arc(26.99,1.31) 26.99,1.31 ; 26.99,1.31 46.04,1.31 ; v1(129.81,29.25) v1(129.81,34.84)
RSHIFT1_4: length 3.5
  Bottom Layer w0.254: RSHIFT1.4 133.83,9.74 arc(133.69,10.07) 133.35,10.21
RSHIFT1_6: length 44
  Bottom Layer w0.254: RSHIFT1.6 arc(123.79,12.49) 125.02,11.98 128.63,11.98 arc(130.51,12.76) 131.3,14.65 arc(132,16.35) 133.71,17.06 160.9,17.06 arc(162.01,16.6) CAPS1.2
S1_4: length 3.5
  Bottom Layer w0.254: 60.01,45.08 60.01,47.84 arc(59.87,48.17) D66.2
S1_6: length 29.7
  Bottom Layer w0.254: 49.46,51.82 arc(49.97,50.59) 51.2,50.08 54.81,50.08 arc(56.69,50.86) 57.48,52.75 arc(58.18,54.45) 59.89,55.16 72.79,55.16 arc(73.9,54.7) D67.2
SPACE1_4: length 3.5
  Bottom Layer w0.254: D43.2 90.49,7.46 arc(90.63,7.12) SPACE1.4
SPACE1_6: length 59.5
  Bottom Layer w0.254: SPACE1.6 80.42,13.32 arc(80.74,12.55) 81.51,12.23 87.09,12.23 arc(88.2,12.69) 88.66,13.8 88.66,18.08 arc(89.1,19.15) 90.18,19.6 128.15,19.6 arc(128.84,19.31) 129.13,18.63 RSHIFT1.2
T1_2: length 29.7
  Bottom Layer w0.254: T1.2 arc(107.24,73.75) 106.13,74.21 93.23,74.21 arc(91.52,73.5) 90.81,71.8 arc(90.03,69.91) 88.15,69.13 84.54,69.13 arc(83.31,69.64) R6.6
TAB1_6: length 32.1
  Bottom Layer w0.254: 8.98,51.82 arc(9.49,50.59) 10.72,50.08 14.33,50.08 arc(16.21,50.86) 16.99,52.75 arc(17.7,54.45) 19.41,55.16 34.69,55.16 arc(35.8,54.7) A1.2
TO1_4: length 3.5
  Bottom Layer w0.254: TO1.4 183.83,28.79 arc(183.69,29.12) D61.2
TO1_6: length 34.4
  Bottom Layer w0.254: UP1.2 arc(202.49,35.65) 201.38,36.11 183.72,36.11 arc(182.01,35.4) 181.3,33.7 arc(180.52,31.81) 178.64,31.03 175.03,31.03 arc(173.8,31.54) TO1.6
U2_2: length 29.7
  Bottom Layer w0.254: U2.2 arc(145.34,73.75) 144.23,74.21 131.33,74.21 arc(129.62,73.5) 128.91,71.8 arc(128.13,69.91) 126.25,69.13 122.64,69.13 arc(121.41,69.64) Y1.6
UP1_4: length 3.5
  Bottom Layer w0.254: UP1.4 207.65,28.79 arc(207.51,29.12) D62.2
UP1_6: length 29.7
  Bottom Layer w0.254: DEL1.2 arc(221.54,35.65) 220.43,36.11 207.53,36.11 arc(205.82,35.4) 205.12,33.7 arc(204.33,31.81) 202.45,31.03 198.84,31.03 arc(197.61,31.54) UP1.6
W1_2: length 29.7
  Bottom Layer w0.254: W1.2 arc(50.09,73.75) 48.98,74.21 36.08,74.21 arc(34.37,73.5) 33.66,71.8 arc(32.88,69.91) 31,69.13 27.39,69.13 arc(26.16,69.64) Q1.6
X2_4: length 3.5
  Bottom Layer w0.254: X2.4 69.53,28.79 arc(69.39,29.12) D55.2
X2_6: length 29.4
  Bottom Layer w0.254: X2.6 58.99,32.5 arc(59.42,31.46) 60.46,31.03 71.38,31.03 arc(72.82,31.63) 73.42,33.06 arc(74.2,34.95) 76.08,35.73 82.7,35.73 arc(83.54,35.38) C9.2
Y1_2: length 29.7
  Bottom Layer w0.254: Y1.2 arc(126.29,73.75) 125.18,74.21 112.28,74.21 arc(110.57,73.5) 109.86,71.8 arc(109.08,69.91) 107.2,69.13 103.59,69.13 arc(102.36,69.64) T1.6
Z1_4: length 3.5
  Bottom Layer w0.254: Z1.4 50.48,28.79 arc(50.34,29.12) D54.2
Z1_6: length 29.7
  Bottom Layer w0.254: X2.2 arc(64.37,35.65) 63.27,36.11 50.36,36.11 arc(48.66,35.4) 47.95,33.7 arc(47.17,31.81) 45.28,31.03 41.68,31.03 arc(40.45,31.54) Z1.6

## Copper pours and planes (outline as drawn; the poured copper is in the pictures)
GND on Top Layer: 228.6,76.2 0,76.2 0,0 0,0 228.6,0
GND on Bottom Layer: 228.6,0 0,0 0,0 0,76.2 0,76.2 228.6,76.2 228.6,76.2

Small or netless copper shapes (teardrops, artwork), in the pictures only: 223 on Top Layer, 474 on Bottom Layer

## Text on the board
Top Solder Mask Layer: Tassel43
Top Silkscreen Layer: Tassel43
